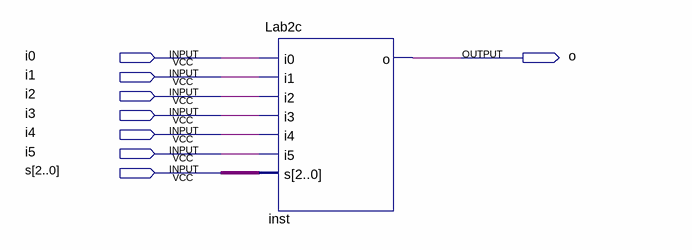
[diagram p0: schematic sheet]
// Quartus schematic Lab2c_bdf.bdf as structural Verilog: 1 symbols, 8 pins
module Lab2c_bdf (
  input  i0,
  input  i1,
  input  i2,
  input  i3,
  input  i4,
  input  i5,
  input  [2:0] s,
  output o
);

  Lab2c inst (.i0(i0), .i1(i1), .i2(i2), .i3(i3), .i4(i4), .i5(i5), .s(s), .o(o));
endmodule
